# Altium schematic sheet 环境监测系统.SchDoc
size A4
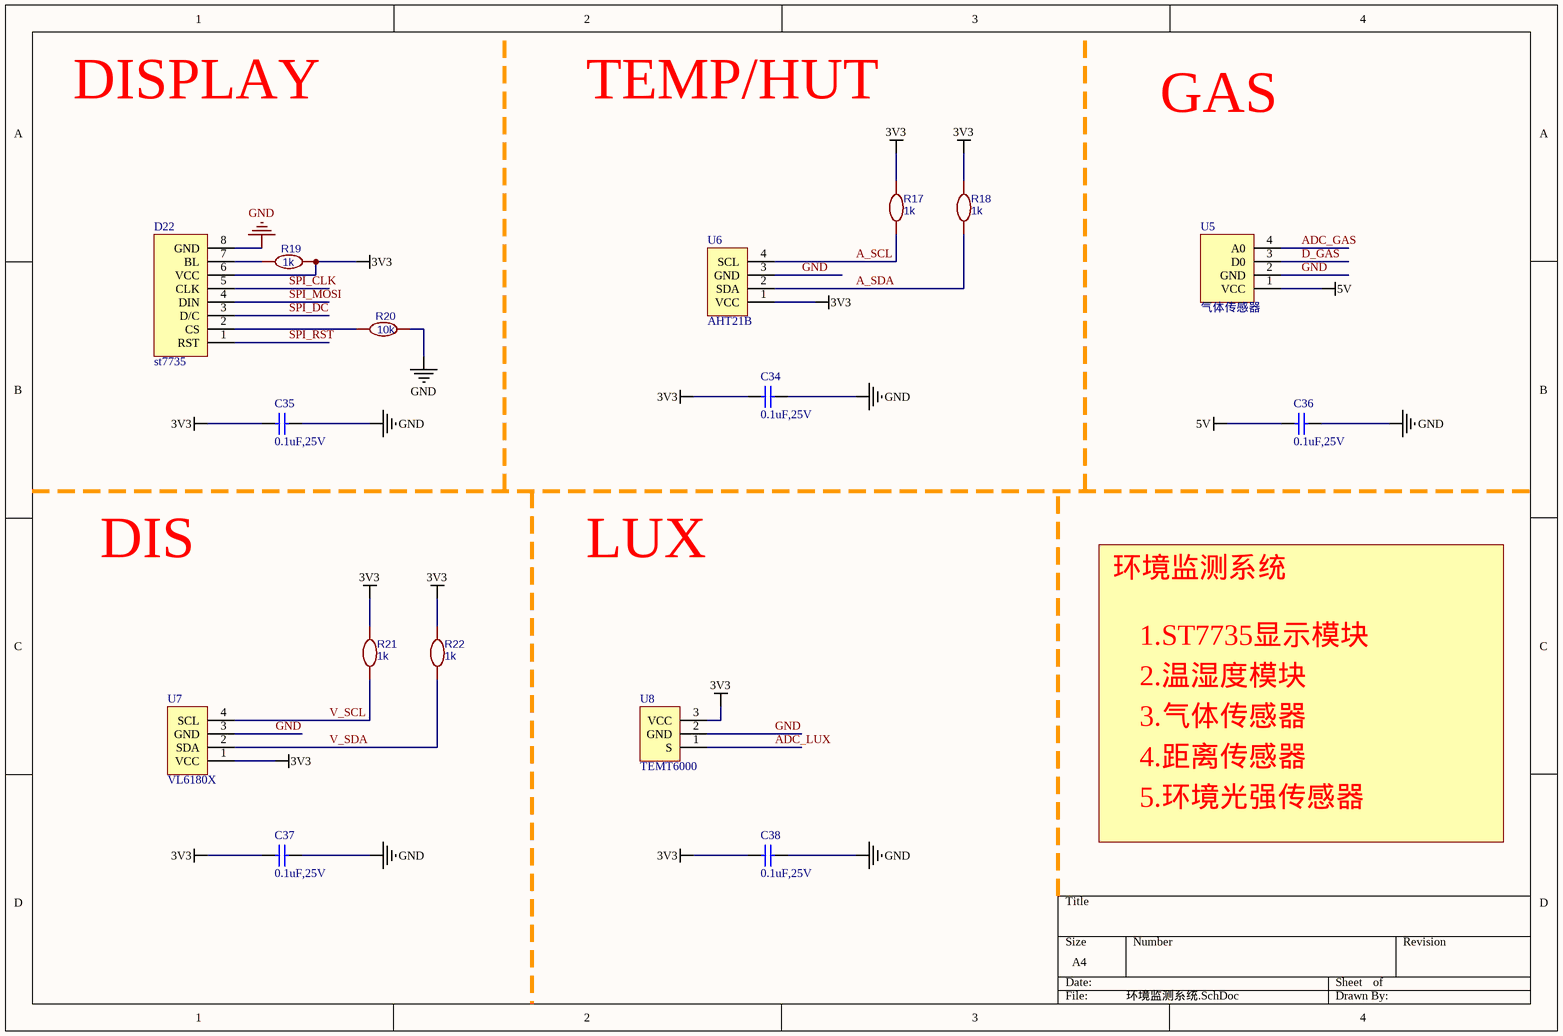
[diagram p0: 环境监测系统.SchDoc]

## Parts
C34  value 0.1uF,25V  [0402_C]  (hidden comment: Cap)
C35  value 0.1uF,25V  [0402_C]  (hidden comment: Cap)
C36  value 0.1uF,25V  [0402_C]  (hidden comment: Cap)
C37  value 0.1uF,25V  [0402_C]  (hidden comment: Cap)
C38  value 0.1uF,25V  [0402_C]  (hidden comment: Cap)
D22  st7735  [HDR1X8]
R17  1k  [0402_R]
R18  1k  [0402_R]
R19  1k  [0402_R]
R20  10k  [0402_R]
R21  1k  [0402_R]
R22  1k  [0402_R]
U5  气体传感器  [XH2.54A-4]
U6  AHT21B  [XH2.54A-4]
U7  VL6180X  [XH2.54A-4]
U8  TEMT6000  [XH2.54A-3]

## Nets
3V3: C34.2 C35.2 C37.2 C38.2 D22.6(VCC) R17.2 R18.2 R19.2 R21.2 R22.2 U6.1(VCC) U7.1(VCC) U8.3(VCC)
5V: C36.2 U5.1(VCC)
GND: C34.1 C35.1 C36.1 C37.1 C38.1 D22.8(GND) R20.2 U5.2(GND) U6.3(GND) U7.3(GND) U8.2(GND)
A_SCL: R17.1 U6.4(SCL)
A_SDA: R18.1 U6.2(SDA)
ADC_GAS: U5.4(A0)
ADC_LUX: U8.1(S)
D_GAS: U5.3(D0)
SPI_CLK: D22.5(CLK)
SPI_DC: D22.3(D/C)
SPI_MOSI: D22.4(DIN)
SPI_RST: D22.1(RST)
V_SCL: R21.1 U7.4(SCL)
V_SDA: R22.1 U7.2(SDA)
NetD22_2: D22.2(CS) R20.1
NetD22_7: D22.7(BL) R19.1

## Notes on the sheet
- DISPLAY
- TEMP/HUT
- GAS
- DIS
- LUX
- 环境监测系统
- 1.ST7735显示模块
- 2.温湿度模块
- 3.气体传感器
- 4.距离传感器
- 5.环境光强传感器

## Library data of the parts
C34-C38 = T_Cap_0603_0.1uF_25V_X5R: 贴片电容; Part Typer: X5R; Solder: SMD; Withstand Voltage: 25V; Tolerance: 10%; Schematic Path: X:\Database\Schematic Library.Schlib; Part Number: T_Cap_0603_0.1uF_25V_X5R; LibRef: T_Cap_0603_0.1uF_25V_X5R
R17-R22 = 1k: nameAlias: Value(Ω); Contributor: LCEDA_Lib; spicePre: R; spiceSymbolName: R_0603_EU
U5 = MQ135